# Altium project STB_LightBoard.PrjPcb (part 8 of 10)

## Sheet LED_Driver_NE2R757GT-P6.SchDoc: STB Light Board - red
size A4; Author: flmoll; DrawnBy: flmoll; Organization: PBL; Revision: A; SheetNumber: 19; SheetTotal: 20
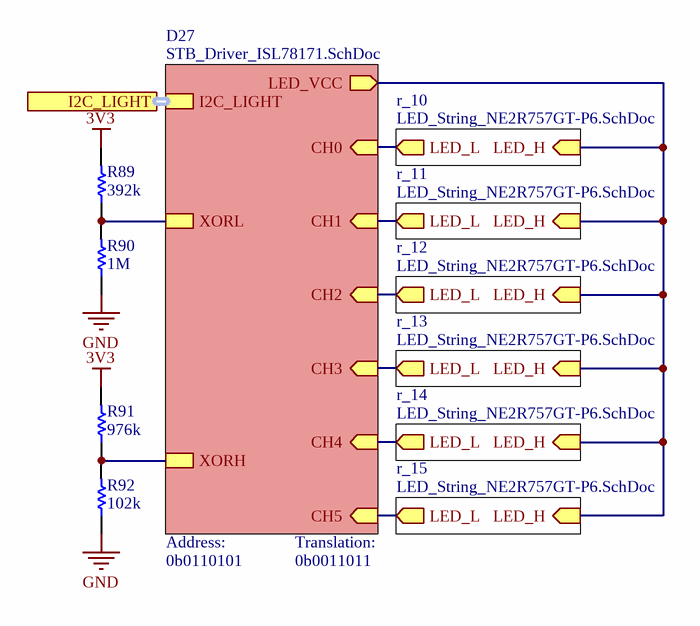
[diagram p16: LED_Driver_NE2R757GT-P6.SchDoc]

### Parts
R89  392k  [RESC1005X40X25LL05T05]
R90  1M  [RESC1005X40X25LL05T05]
R91  976k  [RESC1005X40X25LL05T05]
R92  102k  [RESC1005X40X25LL05T05]

### Sub-sheets
D27 = STB_Driver_ISL78171.SchDoc: CH0 (in), XORL, XORH, LED_VCC (out), CH1 (in), CH2 (in), CH3 (in), CH4 (in), CH5 (in), I2C_LIGHT (harness I2C_LIGHT)
r_10 = LED_String_NE2R757GT-P6.SchDoc: LED_H (in), LED_L (out)
r_11 = LED_String_NE2R757GT-P6.SchDoc: LED_H (in), LED_L (out)
r_12 = LED_String_NE2R757GT-P6.SchDoc: LED_H (in), LED_L (out)
r_13 = LED_String_NE2R757GT-P6.SchDoc: LED_H (in), LED_L (out)
r_14 = LED_String_NE2R757GT-P6.SchDoc: LED_H (in), LED_L (out)
r_15 = LED_String_NE2R757GT-P6.SchDoc: LED_H (in), LED_L (out)

### Ports
I2C_LIGHT (harness I2C_LIGHT, see STB_LightBoard[5C], LED_Driver_AREM-80C0[1A], LED_Driver_AREM-90C0[1A], LED_Driver_NE2B757GT[2B], LED_Driver_NE2G757GT[2B], LED_Driver_NF2L757GT-F1[1A], LED_Driver_NF2W757GT-F1[1A], LED_Driver_QBHP686[1A], STB_Driver_ISL78171[1A], STB_FanControl[1A], STB_UID[1A])

### Nets
3V3: R89.2 R91.2
GND: R90.1 R92.1
NetC7_D27_2: sheet D27/LED_VCC, sheet r_10/LED_H, sheet r_11/LED_H, sheet r_12/LED_H, sheet r_13/LED_H, sheet r_14/LED_H, sheet r_15/LED_H
NetLED134_r_10_1: sheet D27/CH0, sheet r_10/LED_L
NetLED134_r_11_1: sheet D27/CH1, sheet r_11/LED_L
NetLED134_r_12_1: sheet D27/CH2, sheet r_12/LED_L
NetLED134_r_13_1: sheet D27/CH3, sheet r_13/LED_L
NetLED134_r_14_1: sheet D27/CH4, sheet r_14/LED_L
NetLED134_r_15_1: sheet D27/CH5, sheet r_15/LED_L
NetR89_1: R89.1 R90.2 ; sheet D27/XORL
NetR91_1: R91.1 R92.2 ; sheet D27/XORH

### Buses and harness runs
harness port I2C_LIGHT = sheet D27/I2C_LIGHT

### Notes on the sheet
- (near R92) Address:
- 0b0110101
- Translation:
- 0b0011011
- 1
- 2
- 3
- 4
- A
- B
- C
- Project:
- D
- Date:
- Drawing number:
- Rev:
- Format:
- A4 Q
- Drawn by:
- Laboratory:
- Page
- Sheet:
- of
- File:

### Library data of the parts
R89 = CMP-2002-00914-1: Part Number: ERJ-2RKF3923X; Manufacturer: Panasonic; Tolerance: 1%; Rated Power Dissipation (P): 100mW; Rated Temperature: 70°C; Value: 392 kOhm; Temperature Coefficient: 100ppm/°C; Working Voltage: 50V; Package Height: 0.35mm; Package Length: 1mm; Package Width: 0.5mm; Reference Standard: AEC-Q200; Supplier 1: Digi-Key; Supplier Part Number 1: P392KLDKR-ND; Manufacturer Part Number: ERJ-2RKF3923X; RoHS: Yes; Category: Chip SMD Resistors; Stock 1: 100496; Pricing 1: 1=0.10000, 10=0.03300, 100=0.01330, 1000=0.00599, 2500=0.00520, 5000=0.00429 (USD); Mount: Surface Mount; Number of Pins: 2; Size Code: 0402; Terminal Finish: Nickel; Package Shape: Rectangular; Min Operating Temperature: -55°C; Max Operating Temperature: 155°C; JESD-609 Code: e3; Resistor Type: FIXED RESISTOR; Construction: Rectangular; Package Style: SMTMeter; Packaging: Tape and Reel; Technology: METAL GLAZE/THICK FILM; Termination: Wraparound; Reach SVHC Compliant: Yes; RoHS Compliant: Yes; ComponentLink1URL: https://datasheet.ciiva.com:443/pdfs/VipMasterIC/IC/PANA/PANA-S-A0009889626/PANA-S-A0009889626-1.pdf?src-supplier=IHS+Markit; ComponentLink1Description: https://datasheet.ciiva.com:443/pdfs/VipMasterIC/IC/PANA/PANA-S-A0009889626/PANA-S-A0009889626-1.pdf?src-supplier=IHS+Markit; ComponentLink2URL: https://datasheet.ciiva.com/24069/aoa0000ce2-24069223.pdf?src-supplier=Mouser; ComponentLink2Description: https://datasheet.ciiva.com/24069/aoa0000ce2-24069223.pdf?src-supplier=Mouser; ComponentLink3URL: https://datasheet.ciiva.com/30085/aoa0000ce2-30085781.pdf?src-supplier=Onlinecomponents.com; ComponentLink3Description: https://datasheet.ciiva.com/30085/aoa0000ce2-30085781.pdf?src-supplier=Onlinecomponents.com; ComponentLink4URL: https://datasheet.ciiva.com/16781/70260748-16781463.pdf?src-supplier=Allied+Electronics; ComponentLink4Description: https://datasheet.ciiva.com/16781/70260748-16781463.pdf?src-supplier=Allied+Electronics; ComponentLink5URL: https://datasheet.ciiva.com/22673/1678782-22673356.pdf?src-supplier=Element14; ComponentLink5Description: https://datasheet.ciiva.com/22673/1678782-22673356.pdf?src-supplier=Element14; ComponentLink6URL: https://datasheet.ciiva.com/46399/1678782-46399980.pdf?src-supplier=Element14; ComponentLink6Description: https://datasheet.ciiva.com/46399/1678782-46399980.pdf?src-supplier=Element14; ComponentLink7URL: https://datasheet.ciiva.com/46399/1678782-46399981.pdf?src-supplier=Element14; ComponentLink7Description: https://datasheet.ciiva.com/46399/1678782-46399981.pdf?src-supplier=Element14; ComponentLink8URL: https://datasheet.ciiva.com/22776/1678782-22776542.pdf?src-supplier=Farnell; ComponentLink8Description: https://datasheet.ciiva.com/22776/1678782-22776542.pdf?src-supplier=Farnell; ComponentLink9URL: https://datasheet.ciiva.com/16774/70260748-16774815.pdf?src-supplier=Allied+Electronics; ComponentLink9Description: https://datasheet.ciiva.com/16774/70260748-16774815.pdf?src-supplier=Allied+Electronics
R90 = CMP-2002-00609-3: Chip Resistor, 1 MOhm, +/- 1%, 100 mW, -55 to 155 degC, 0402 (1005 Metric), RoHS, Tape and Reel; PartNumber: ERJ-2RKF1004X; Manufacturer: Basic Passives; Voltage Rating: 50 V; Case\/Package: 0402; Value: 1 MOhm; Power Rating: 100 mW; Rated Power Dissipation (P): 100mW; Temperature Coefficient: 100ppm/°C; Working Voltage: 50V; Rated Temperature: 70°C; Package Height: 0.35mm; Package Length: 1mm; Package Width: 0.5mm; Reference Standard: AEC-Q200; Pins: 2; Max Operating Temperature: 155 degC; ComponentLink2URL: http://industrial.panasonic.com/cdbs/www-data/pdf/RDA0000/AOA0000C86.pdf; Weight: 2.8E-05oz; ComponentLink1URL: http://www.panasonic.com/; Radiation Hardening: No; Height: 0.35 mm; Case Code (Imperial): 0402; ComponentLink2Description: Datasheet; Mount: Surface Mount; ComponentLink1Description: Manufacturer URL; REACH SVHC: Yes; Length: 1 mm; Min Operating Temperature: -55 degC; Width: 0.5 mm; Package Quantity: 10000; Tolerance: 1%; PackageDescription: 2-Pin Surface Mount Device, Body 1 x 0.5 mm; RoHSCompliant: true; DatasheetVersion: 04/2015; PackageReference: 0402; Mounting Technology: Surface Mount; Case Code (Metric): 1005; Packaging: Tape and Reel; Supplier 1: Digi-Key; Supplier Part Number 1: P1.00MLDKR-ND; Manufacturer Part Number: ERJ-2RKF1004X; RoHS: Yes; Category: Chip SMD Resistors; Stock 1: 1012879; Pricing 1: 1=0.10000, 10=0.03300, 100=0.01330, 1000=0.00599, 2500=0.00520, 5000=0.00429 (USD); Number of Pins: 2; Package Shape: Rectangular; Size Code: 0402; Terminal Finish: Nickel; JESD-609 Code: e3; Resistor Type: FIXED RESISTOR; Construction: Rectangular; Package Style: SMTMeter; Technology: METAL GLAZE/THICK FILM; Termination: Wraparound; Reach SVHC Compliant: Yes; RoHS Compliant: Yes; ComponentLink3URL: https://datasheet.ciiva.com:443/pdfs/VipMasterIC/IC/PANA/PANA-S-A0009889626/PANA-S-A0009889626-1.pdf?src-supplier=IHS+Markit; ComponentLink3Description: https://datasheet.ciiva.com:443/pdfs/VipMasterIC/IC/PANA/PANA-S-A0009889626/PANA-S-A0009889626-1.pdf?src-supplier=IHS+Markit; ComponentLink4URL: https://datasheet.ciiva.com/34303/1987046-34303551.pdf?src-supplier=Jameco; ComponentLink4Description: https://datasheet.ciiva.com/34303/1987046-34303551.pdf?src-supplier=Jameco; ComponentLink5URL: https://datasheet.ciiva.com/11821/0900766b80f80784-11821229.pdf?src-supplier=RSComponents; ComponentLink5Description: https://datasheet.ciiva.com/11821/0900766b80f80784-11821229.pdf?src-supplier=RSComponents; ComponentLink6URL: https://datasheet.ciiva.com/7909/aoa0000ce2-7909180.pdf?src-supplier=Element14; ComponentLink6Description: https://datasheet.ciiva.com/7909/aoa0000ce2-7909180.pdf?src-supplier=Element14; ComponentLink7URL: https://datasheet.ciiva.com/22723/1678782-22723164.pdf?src-supplier=Element14; ComponentLink7Description: https://datasheet.ciiva.com/22723/1678782-22723164.pdf?src-supplier=Element14; ComponentLink8URL: https://datasheet.ciiva.com/24158/aoa0000ce2-24158990.pdf?src-supplier=Mouser; ComponentLink8Description: https://datasheet.ciiva.com/24158/aoa0000ce2-24158990.pdf?src-supplier=Mouser; ComponentLink9URL: https://datasheet.ciiva.com/16766/70260748-16766711.pdf?src-supplier=Allied+Electronics; ComponentLink9Description: https://datasheet.ciiva.com/16766/70260748-16766711.pdf?src-supplier=Allied+Electronics; ComponentLink10URL: https://datasheet.ciiva.com/16779/70260748-16779288.pdf?src-supplier=Allied+Electronics; ComponentLink10Description: https://datasheet.ciiva.com/16779/70260748-16779288.pdf?src-supplier=Allied+Electronics; ComponentLink11URL: https://datasheet.ciiva.com/16199/aoa0000ce2-16199544.pdf?src-supplier=Future+Electronics; ComponentLink11Description: https://datasheet.ciiva.com/16199/aoa0000ce2-16199544.pdf?src-supplier=Future+Electronics
R91 = CMP-2002-01120-1: Manufacturer: Panasonic; Part Number: ERJ-2RKF9763X; Tolerance: 1%; Rated Power Dissipation (P): 100mW; Rated Temperature: 70°C; Value: 976 kOhm; Temperature Coefficient: 100ppm/°C; Working Voltage: 50V; Package Height: 0.35mm; Package Length: 1mm; Package Width: 0.5mm; Reference Standard: AEC-Q200; Supplier 1: Digi-Key; Supplier Part Number 1: P976KLCT-ND; Manufacturer Part Number: ERJ-2RKF9763X; RoHS: Yes; Category: Chip SMD Resistors; Stock 1: 136638; Pricing 1: 1=0.10000, 10=0.03300, 100=0.01330, 1000=0.00599, 2500=0.00520, 5000=0.00429 (USD); Mount: Surface Mount; Number of Pins: 2; Size Code: 0402; Terminal Finish: Nickel; Package Shape: Rectangular; Min Operating Temperature: -55°C; Max Operating Temperature: 155°C; Resistor Type: FIXED RESISTOR; Construction: Rectangular; Package Style: SMTMeter; Packaging: Tape and Reel; Termination: Wraparound; JESD-609 Code: e3; Technology: METAL GLAZE/THICK FILM; Reach SVHC Compliant: Yes; RoHS Compliant: Yes; ComponentLink1URL: https://datasheet.ciiva.com:443/pdfs/VipMasterIC/IC/PANA/PANA-S-A0009889626/PANA-S-A0009889626-1.pdf?src-supplier=IHS+Markit; ComponentLink1Description: https://datasheet.ciiva.com:443/pdfs/VipMasterIC/IC/PANA/PANA-S-A0009889626/PANA-S-A0009889626-1.pdf?src-supplier=IHS+Markit; ComponentLink2URL: https://datasheet.ciiva.com/43467/1678782-43467581.pdf?src-supplier=Farnell; ComponentLink2Description: https://datasheet.ciiva.com/43467/1678782-43467581.pdf?src-supplier=Farnell; ComponentLink3URL: https://datasheet.ciiva.com/46372/1678782-46372911.pdf?src-supplier=Element14; ComponentLink3Description: https://datasheet.ciiva.com/46372/1678782-46372911.pdf?src-supplier=Element14; ComponentLink4URL: https://datasheet.ciiva.com/22668/1678782-22668415.pdf?src-supplier=Element14; ComponentLink4Description: https://datasheet.ciiva.com/22668/1678782-22668415.pdf?src-supplier=Element14; ComponentLink5URL: https://datasheet.ciiva.com/16758/70260748-16758903.pdf?src-supplier=Allied+Electronics; ComponentLink5Description: https://datasheet.ciiva.com/16758/70260748-16758903.pdf?src-supplier=Allied+Electronics; ComponentLink6URL: https://datasheet.ciiva.com/9179/aoa0000ce2-9179357.pdf?src-supplier=Avnet; ComponentLink6Description: https://datasheet.ciiva.com/9179/aoa0000ce2-9179357.pdf?src-supplier=Avnet; ComponentLink7URL: https://datasheet.ciiva.com/30176/aoa0000ce2-30176831.pdf?src-supplier=Onlinecomponents.com; ComponentLink7Description: https://datasheet.ciiva.com/30176/aoa0000ce2-30176831.pdf?src-supplier=Onlinecomponents.com
R92 = CMP-2002-00613-1: Manufacturer: Panasonic; Part Number: ERJ-2RKF1023X; Tolerance: 1%; Rated Power Dissipation (P): 100mW; Rated Temperature: 70°C; Value: 102 kOhm; Temperature Coefficient: 100ppm/°C; Working Voltage: 50V; Package Height: 0.35mm; Package Length: 1mm; Package Width: 0.5mm; Reference Standard: AEC-Q200; Supplier 1: Digi-Key; Supplier Part Number 1: P102KLDKR-ND; Manufacturer Part Number: ERJ-2RKF1023X; RoHS: Yes; Category: Chip SMD Resistors; Stock 1: 79400; Pricing 1: 1=0.10000, 10=0.03300, 100=0.01330, 1000=0.00599, 2500=0.00520, 5000=0.00429 (USD); Mount: Surface Mount; Number of Pins: 2; Size Code: 0402; Terminal Finish: Nickel; Package Shape: Rectangular; Min Operating Temperature: -55°C; Max Operating Temperature: 155°C; Resistor Type: FIXED RESISTOR; Construction: Rectangular; Package Style: SMTMeter; Packaging: Tape and Reel; Technology: METAL GLAZE/THICK FILM; Termination: Wraparound; JESD-609 Code: e3; Reach SVHC Compliant: Yes; RoHS Compliant: Yes; ComponentLink1URL: https://datasheet.ciiva.com:443/pdfs/VipMasterIC/IC/PANA/PANA-S-A0009889626/PANA-S-A0009889626-1.pdf?src-supplier=IHS+Markit; ComponentLink1Description: https://datasheet.ciiva.com:443/pdfs/VipMasterIC/IC/PANA/PANA-S-A0009889626/PANA-S-A0009889626-1.pdf?src-supplier=IHS+Markit; ComponentLink2URL: https://datasheet.ciiva.com/43467/1678782-43467481.pdf?src-supplier=Farnell; ComponentLink2Description: https://datasheet.ciiva.com/43467/1678782-43467481.pdf?src-supplier=Farnell; ComponentLink3URL: https://datasheet.ciiva.com/9119/aoa0000ce2-9119242.pdf?src-supplier=Avnet; ComponentLink3Description: https://datasheet.ciiva.com/9119/aoa0000ce2-9119242.pdf?src-supplier=Avnet; ComponentLink4URL: https://datasheet.ciiva.com/16781/70260748-16781503.pdf?src-supplier=Allied+Electronics; ComponentLink4Description: https://datasheet.ciiva.com/16781/70260748-16781503.pdf?src-supplier=Allied+Electronics; ComponentLink5URL: https://datasheet.ciiva.com/22673/1678782-22673487.pdf?src-supplier=Element14; ComponentLink5Description: https://datasheet.ciiva.com/22673/1678782-22673487.pdf?src-supplier=Element14; ComponentLink6URL: https://datasheet.ciiva.com/16763/70260748-16763080.pdf?src-supplier=Allied+Electronics; ComponentLink6Description: https://datasheet.ciiva.com/16763/70260748-16763080.pdf?src-supplier=Allied+Electronics; ComponentLink7URL: https://datasheet.ciiva.com/7712/1678782-7712798.pdf?src-supplier=Element14; ComponentLink7Description: https://datasheet.ciiva.com/7712/1678782-7712798.pdf?src-supplier=Element14; ComponentLink8URL: https://datasheet.ciiva.com/46373/1678782-46373215.pdf?src-supplier=Element14; ComponentLink8Description: https://datasheet.ciiva.com/46373/1678782-46373215.pdf?src-supplier=Element14

## Sheet LED_String_NE2R757GT-P6.SchDoc: STB Light Board - blue String
size A4; Author: flmoll; DrawnBy: flmoll; Organization: PBL; Revision: A; SheetNumber: 20; SheetTotal: 20
Used 6 times, as channels LR/r_10, LR/r_11, LR/r_12, LR/r_13, LR/r_14, LR/r_15. Parts and nets are listed once, with the designators drawn on the sheet.
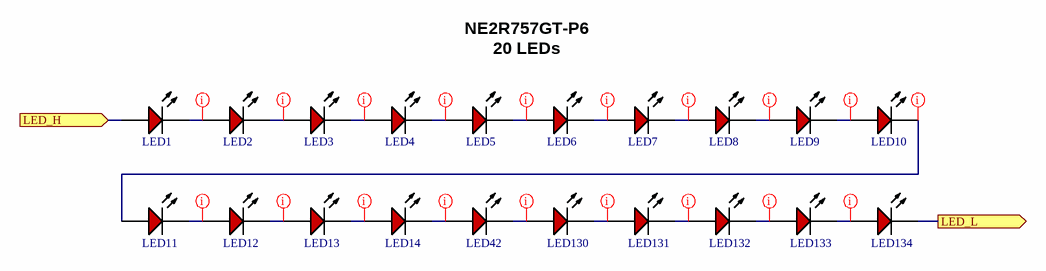
[diagram p17: LED_String_NE2R757GT-P6.SchDoc]

### Parts
LED1  NE2R757GT-P6  [NE2R757GT-P6]  (value not drawn)
LED2  NE2R757GT-P6  [NE2R757GT-P6]  (value not drawn)
LED3  NE2R757GT-P6  [NE2R757GT-P6]  (value not drawn)
LED4  NE2R757GT-P6  [NE2R757GT-P6]  (value not drawn)
LED5  NE2R757GT-P6  [NE2R757GT-P6]  (value not drawn)
LED6  NE2R757GT-P6  [NE2R757GT-P6]  (value not drawn)
LED7  NE2R757GT-P6  [NE2R757GT-P6]  (value not drawn)
LED8  NE2R757GT-P6  [NE2R757GT-P6]  (value not drawn)
LED9  NE2R757GT-P6  [NE2R757GT-P6]  (value not drawn)
LED10  NE2R757GT-P6  [NE2R757GT-P6]  (value not drawn)
LED11  NE2R757GT-P6  [NE2R757GT-P6]  (value not drawn)
LED12  NE2R757GT-P6  [NE2R757GT-P6]  (value not drawn)
LED13  NE2R757GT-P6  [NE2R757GT-P6]  (value not drawn)
LED14  NE2R757GT-P6  [NE2R757GT-P6]  (value not drawn)
LED42  NE2R757GT-P6  [NE2R757GT-P6]  (value not drawn)
LED130  NE2R757GT-P6  [NE2R757GT-P6]  (value not drawn)
LED131  NE2R757GT-P6  [NE2R757GT-P6]  (value not drawn)
LED132  NE2R757GT-P6  [NE2R757GT-P6]  (value not drawn)
LED133  NE2R757GT-P6  [NE2R757GT-P6]  (value not drawn)
LED134  NE2R757GT-P6  [NE2R757GT-P6]  (value not drawn)

### Ports
LED_H (in, see LED_Driver_NE2R757GT-P6[3B]), LED_L (out, see LED_Driver_NE2R757GT-P6[3B])

### Nets
LED_H: LED1.2(A) ; port LED_H
LED_L: LED134.1(K) ; port LED_L
NetLED1_1: LED1.1(K) LED2.2(A)
NetLED2_1: LED2.1(K) LED3.2(A)
NetLED3_1: LED3.1(K) LED4.2(A)
NetLED4_1: LED4.1(K) LED5.2(A)
NetLED5_1: LED5.1(K) LED6.2(A)
NetLED6_1: LED6.1(K) LED7.2(A)
NetLED7_1: LED7.1(K) LED8.2(A)
NetLED8_1: LED8.1(K) LED9.2(A)
NetLED9_1: LED9.1(K) LED10.2(A)
NetLED10_1: LED10.1(K) LED11.2(A)
NetLED11_1: LED11.1(K) LED12.2(A)
NetLED12_1: LED12.1(K) LED13.2(A)
NetLED13_1: LED13.1(K) LED14.2(A)
NetLED14_1: LED14.1(K) LED42.2(A)
NetLED42_1: LED42.1(K) LED130.2(A)
NetLED130_1: LED130.1(K) LED131.2(A)
NetLED131_1: LED131.1(K) LED132.2(A)
NetLED132_1: LED132.1(K) LED133.2(A)
NetLED133_1: LED133.1(K) LED134.2(A)

### Channels
LR/r_10: designators end in _r_10; ports LED_H=NetC7_D27_2 LED_L=NetLED134_r_10_1
LR/r_11: designators end in _r_11; ports LED_H=NetC7_D27_2 LED_L=NetLED134_r_11_1
LR/r_12: designators end in _r_12; ports LED_H=NetC7_D27_2 LED_L=NetLED134_r_12_1
LR/r_13: designators end in _r_13; ports LED_H=NetC7_D27_2 LED_L=NetLED134_r_13_1
LR/r_14: designators end in _r_14; ports LED_H=NetC7_D27_2 LED_L=NetLED134_r_14_1
LR/r_15: designators end in _r_15; ports LED_H=NetC7_D27_2 LED_L=NetLED134_r_15_1

### Layout directives
net class LED: NetLED1_r_10_1, NetLED2_r_10_1, NetLED3_r_10_1, NetLED4_r_10_1, NetLED5_r_10_1, NetLED6_r_10_1, NetLED7_r_10_1, NetLED8_r_10_1, NetLED9_r_10_1, NetLED10_r_10_1, NetLED11_r_10_1, NetLED12_r_10_1, NetLED13_r_10_1, NetLED14_r_10_1, NetLED42_r_10_1, NetLED130_r_10_1, NetLED131_r_10_1, NetLED132_r_10_1, NetLED133_r_10_1

### Notes on the sheet
- NE2R757GT-P6
- 20 LEDs
- 1
- 2
- 3
- 4
- A
- B
- C
- Project:
- D
- Date:
- Drawing number:
- Rev:
- Format:
- A4 Q
- Drawn by:
- Laboratory:
- Page
- Sheet:
- of
- File:

### Library data of the parts
LED1-LED14 LED42 LED130-LED134 = CMP-02062-1: SMD LED Red 2,13 V, 16 lm 3030 (1212); Manufacturer: Nichia; Optoelectronic Device Type: SINGLE COLOR LED; Vf: 2.13 V; Intensity: 16 lm; REACH SVHC: No SVHC; RoHS Compliant: Yes; Color: Red; Manufacturer Part Number: NE2R757GT-P6

## Sheet LED_Driver_NE2B757GT.SchDoc: STB Light Board - blue
size A4; Author: flmoll; DrawnBy: flmoll; Organization: PBL; Revision: A; SheetNumber: 9; SheetTotal: 20
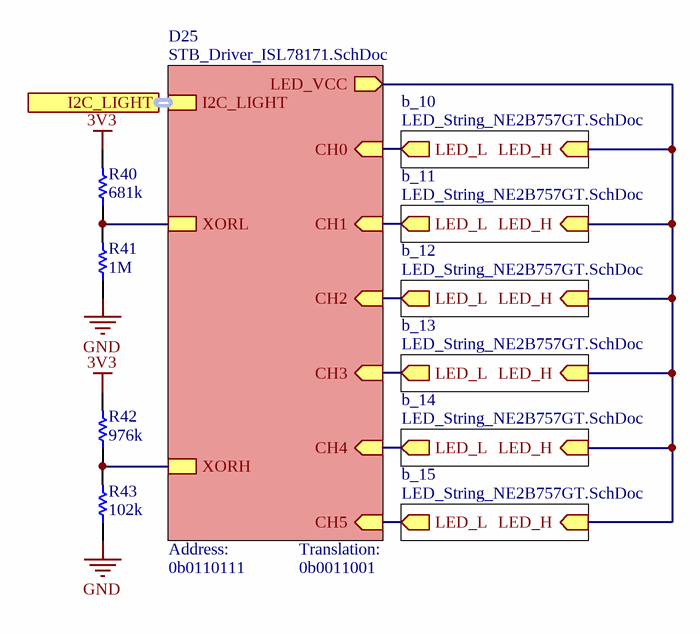
[diagram p18: LED_Driver_NE2B757GT.SchDoc]

### Parts
R40  681k  [RESC1005X40X25LL05T05]
R41  1M  [RESC1005X40X25LL05T05]
R42  976k  [RESC1005X40X25LL05T05]
R43  102k  [RESC1005X40X25LL05T05]

### Sub-sheets
b_10 = LED_String_NE2B757GT.SchDoc: LED_H (in), LED_L (out)
b_11 = LED_String_NE2B757GT.SchDoc: LED_H (in), LED_L (out)
b_12 = LED_String_NE2B757GT.SchDoc: LED_H (in), LED_L (out)
b_13 = LED_String_NE2B757GT.SchDoc: LED_H (in), LED_L (out)
b_14 = LED_String_NE2B757GT.SchDoc: LED_H (in), LED_L (out)
b_15 = LED_String_NE2B757GT.SchDoc: LED_H (in), LED_L (out)
D25 = STB_Driver_ISL78171.SchDoc: CH0 (in), XORL, XORH, LED_VCC (out), CH1 (in), CH2 (in), CH3 (in), CH4 (in), CH5 (in), I2C_LIGHT (harness I2C_LIGHT)

### Ports
I2C_LIGHT (harness I2C_LIGHT, see STB_LightBoard[5C], LED_Driver_AREM-80C0[1A], LED_Driver_AREM-90C0[1A], LED_Driver_NE2G757GT[2B], LED_Driver_NE2R757GT-P6[2B], LED_Driver_NF2L757GT-F1[1A], LED_Driver_NF2W757GT-F1[1A], LED_Driver_QBHP686[1A], STB_Driver_ISL78171[1A], STB_FanControl[1A], STB_UID[1A])

### Nets
3V3: R40.2 R42.2
GND: R41.1 R43.1
NetC7_D25_2: sheet D25/LED_VCC, sheet b_10/LED_H, sheet b_11/LED_H, sheet b_12/LED_H, sheet b_13/LED_H, sheet b_14/LED_H, sheet b_15/LED_H
NetLED148_b_10_1: sheet D25/CH0, sheet b_10/LED_L
NetLED148_b_11_1: sheet D25/CH1, sheet b_11/LED_L
NetLED148_b_12_1: sheet D25/CH2, sheet b_12/LED_L
NetLED148_b_13_1: sheet D25/CH3, sheet b_13/LED_L
NetLED148_b_14_1: sheet D25/CH4, sheet b_14/LED_L
NetLED148_b_15_1: sheet D25/CH5, sheet b_15/LED_L
NetR40_1: R40.1 R41.2 ; sheet D25/XORL
NetR42_1: R42.1 R43.2 ; sheet D25/XORH

### Buses and harness runs
harness port I2C_LIGHT = sheet D25/I2C_LIGHT

### Notes on the sheet
- (near R43) Address:
- 0b0110111
- Translation:
- 0b0011001
- 1
- 2
- 3
- 4
- A
- B
- C
- Project:
- D
- Date:
- Drawing number:
- Rev:
- Format:
- A4 Q
- Drawn by:
- Laboratory:
- Page
- Sheet:
- of
- File:

### Library data of the parts
R40 = CMP-2002-01040-1: Manufacturer: Panasonic; Part Number: ERJ-2RKF6813X; Tolerance: 1%; Rated Power Dissipation (P): 100mW; Rated Temperature: 70°C; Value: 681 kOhm; Temperature Coefficient: 100ppm/°C; Working Voltage: 50V; Package Height: 0.35mm; Package Length: 1mm; Package Width: 0.5mm; Reference Standard: AEC-Q200; Supplier 1: Digi-Key; Supplier Part Number 1: P681KLCT-ND; Manufacturer Part Number: ERJ-2RKF6813X; RoHS: Yes; Category: Chip SMD Resistors; Stock 1: 3837; Pricing 1: 1=0.10000, 10=0.03300, 100=0.01330, 1000=0.00599, 2500=0.00520, 5000=0.00429 (USD); Mount: Surface Mount; Number of Pins: 2; Size Code: 0402; Terminal Finish: Nickel; Package Shape: Rectangular; Min Operating Temperature: -55°C; Max Operating Temperature: 155°C; Resistor Type: FIXED RESISTOR; Packaging: Tape and Reel; Termination: Wraparound; Construction: Rectangular; Package Style: SMTMeter; Technology: METAL GLAZE/THICK FILM; JESD-609 Code: e3; Reach SVHC Compliant: Yes; RoHS Compliant: Yes; ComponentLink1URL: https://datasheet.ciiva.com:443/pdfs/VipMasterIC/IC/PANA/PANA-S-A0009889626/PANA-S-A0009889626-1.pdf?src-supplier=IHS+Markit; ComponentLink1Description: https://datasheet.ciiva.com:443/pdfs/VipMasterIC/IC/PANA/PANA-S-A0009889626/PANA-S-A0009889626-1.pdf?src-supplier=IHS+Markit; ComponentLink2URL: https://datasheet.ciiva.com/3883/3984280s8821682n1386-3883650.pdf?src-supplier=Arrow+Electronics; ComponentLink2Description: https://datasheet.ciiva.com/3883/3984280s8821682n1386-3883650.pdf?src-supplier=Arrow+Electronics; ComponentLink3URL: https://datasheet.ciiva.com/16776/70260748-16776822.pdf?src-supplier=Allied+Electronics; ComponentLink3Description: https://datasheet.ciiva.com/16776/70260748-16776822.pdf?src-supplier=Allied+Electronics; ComponentLink4URL: https://datasheet.ciiva.com/9180/aoa0000ce2-9180392.pdf?src-supplier=Avnet; ComponentLink4Description: https://datasheet.ciiva.com/9180/aoa0000ce2-9180392.pdf?src-supplier=Avnet; ComponentLink5URL: https://datasheet.ciiva.com/22673/1678782-22673368.pdf?src-supplier=Element14; ComponentLink5Description: https://datasheet.ciiva.com/22673/1678782-22673368.pdf?src-supplier=Element14; ComponentLink6URL: https://datasheet.ciiva.com/7753/1678782-7753993.pdf?src-supplier=Element14; ComponentLink6Description: https://datasheet.ciiva.com/7753/1678782-7753993.pdf?src-supplier=Element14; ComponentLink7URL: https://datasheet.ciiva.com/16771/70260748-16771449.pdf?src-supplier=Allied+Electronics; ComponentLink7Description: https://datasheet.ciiva.com/16771/70260748-16771449.pdf?src-supplier=Allied+Electronics; ComponentLink8URL: https://datasheet.ciiva.com/9180/aoa0000ce2-9180348.pdf?src-supplier=Avnet; ComponentLink8Description: https://datasheet.ciiva.com/9180/aoa0000ce2-9180348.pdf?src-supplier=Avnet; ComponentLink9URL: https://datasheet.ciiva.com/43467/1678782-43467564.pdf?src-supplier=Farnell; ComponentLink9Description: https://datasheet.ciiva.com/43467/1678782-43467564.pdf?src-supplier=Farnell; ComponentLink10URL: https://datasheet.ciiva.com/24069/aoa0000ce2-24069822.pdf?src-supplier=Mouser; ComponentLink10Description: https://datasheet.ciiva.com/24069/aoa0000ce2-24069822.pdf?src-supplier=Mouser; ComponentLink11URL: https://datasheet.ciiva.com/46373/1678782-46373118.pdf?src-supplier=Element14; ComponentLink11Description: https://datasheet.ciiva.com/46373/1678782-46373118.pdf?src-supplier=Element14; ComponentLink12URL: https://datasheet.ciiva.com/30230/aoa0000ce2-30230479.pdf?src-supplier=Onlinecomponents.com; ComponentLink12Description: https://datasheet.ciiva.com/30230/aoa0000ce2-30230479.pdf?src-supplier=Onlinecomponents.com; ComponentLink13URL: https://datasheet.ciiva.com/46373/1678782-46373119.pdf?src-supplier=Element14; ComponentLink13Description: https://datasheet.ciiva.com/46373/1678782-46373119.pdf?src-supplier=Element14
R41 = CMP-2002-00609-3: as R90 on sheet LED_Driver_NE2R757GT-P6; Pins: 2; Max Operating Temperature: 155 degC; ComponentLink2URL: http://industrial.panasonic.com/cdbs/www-data/pdf/RDA0000/AOA0000C86.pdf; Weight: 2.8E-05oz; ComponentLink1URL: http://www.panasonic.com/; Radiation Hardening: No; Height: 0.35 mm; Case Code (Imperial): 0402; ComponentLink2Description: Datasheet; Mount: Surface Mount; ComponentLink1Description: Manufacturer URL; REACH SVHC: Yes; Length: 1 mm; Min Operating Temperature: -55 degC; Width: 0.5 mm; Package Quantity: 10000; Tolerance: 1%; PackageDescription: 2-Pin Surface Mount Device, Body 1 x 0.5 mm; RoHSCompliant: true; DatasheetVersion: 04/2015; PackageReference: 0402; Mounting Technology: Surface Mount; Case Code (Metric): 1005; Packaging: Tape and Reel; Supplier 1: Digi-Key; Supplier Part Number 1: P1.00MLDKR-ND; Manufacturer Part Number: ERJ-2RKF1004X; RoHS: Yes; Category: Chip SMD Resistors; Stock 1: 1012879; Pricing 1: 1=0.10000, 10=0.03300, 100=0.01330, 1000=0.00599, 2500=0.00520, 5000=0.00429 (USD); Number of Pins: 2; Package Shape: Rectangular; Size Code: 0402; Terminal Finish: Nickel; JESD-609 Code: e3; Resistor Type: FIXED RESISTOR; Construction: Rectangular; Package Style: SMTMeter; Technology: METAL GLAZE/THICK FILM; Termination: Wraparound; Reach SVHC Compliant: Yes; RoHS Compliant: Yes; ComponentLink3URL: https://datasheet.ciiva.com:443/pdfs/VipMasterIC/IC/PANA/PANA-S-A0009889626/PANA-S-A0009889626-1.pdf?src-supplier=IHS+Markit; ComponentLink3Description: https://datasheet.ciiva.com:443/pdfs/VipMasterIC/IC/PANA/PANA-S-A0009889626/PANA-S-A0009889626-1.pdf?src-supplier=IHS+Markit; ComponentLink4URL: https://datasheet.ciiva.com/34303/1987046-34303551.pdf?src-supplier=Jameco; ComponentLink4Description: https://datasheet.ciiva.com/34303/1987046-34303551.pdf?src-supplier=Jameco; ComponentLink5URL: https://datasheet.ciiva.com/11821/0900766b80f80784-11821229.pdf?src-supplier=RSComponents; ComponentLink5Description: https://datasheet.ciiva.com/11821/0900766b80f80784-11821229.pdf?src-supplier=RSComponents; ComponentLink6URL: https://datasheet.ciiva.com/7909/aoa0000ce2-7909180.pdf?src-supplier=Element14; ComponentLink6Description: https://datasheet.ciiva.com/7909/aoa0000ce2-7909180.pdf?src-supplier=Element14; ComponentLink7URL: https://datasheet.ciiva.com/22723/1678782-22723164.pdf?src-supplier=Element14; ComponentLink7Description: https://datasheet.ciiva.com/22723/1678782-22723164.pdf?src-supplier=Element14; ComponentLink8URL: https://datasheet.ciiva.com/24158/aoa0000ce2-24158990.pdf?src-supplier=Mouser; ComponentLink8Description: https://datasheet.ciiva.com/24158/aoa0000ce2-24158990.pdf?src-supplier=Mouser; ComponentLink9URL: https://datasheet.ciiva.com/16766/70260748-16766711.pdf?src-supplier=Allied+Electronics; ComponentLink9Description: https://datasheet.ciiva.com/16766/70260748-16766711.pdf?src-supplier=Allied+Electronics; ComponentLink10URL: https://datasheet.ciiva.com/16779/70260748-16779288.pdf?src-supplier=Allied+Electronics; ComponentLink10Description: https://datasheet.ciiva.com/16779/70260748-16779288.pdf?src-supplier=Allied+Electronics; ComponentLink11URL: https://datasheet.ciiva.com/16199/aoa0000ce2-16199544.pdf?src-supplier=Future+Electronics; ComponentLink11Description: https://datasheet.ciiva.com/16199/aoa0000ce2-16199544.pdf?src-supplier=Future+Electronics
R42 = CMP-2002-01120-1: as R91 on sheet LED_Driver_NE2R757GT-P6; Supplier 1: Digi-Key; Supplier Part Number 1: P976KLCT-ND; Manufacturer Part Number: ERJ-2RKF9763X; RoHS: Yes; Category: Chip SMD Resistors; Stock 1: 136638; Pricing 1: 1=0.10000, 10=0.03300, 100=0.01330, 1000=0.00599, 2500=0.00520, 5000=0.00429 (USD); Mount: Surface Mount; Number of Pins: 2; Size Code: 0402; Terminal Finish: Nickel; Package Shape: Rectangular; Min Operating Temperature: -55°C; Max Operating Temperature: 155°C; Resistor Type: FIXED RESISTOR; Construction: Rectangular; Package Style: SMTMeter; Packaging: Tape and Reel; Termination: Wraparound; JESD-609 Code: e3; Technology: METAL GLAZE/THICK FILM; Reach SVHC Compliant: Yes; RoHS Compliant: Yes; ComponentLink1URL: https://datasheet.ciiva.com:443/pdfs/VipMasterIC/IC/PANA/PANA-S-A0009889626/PANA-S-A0009889626-1.pdf?src-supplier=IHS+Markit; ComponentLink1Description: https://datasheet.ciiva.com:443/pdfs/VipMasterIC/IC/PANA/PANA-S-A0009889626/PANA-S-A0009889626-1.pdf?src-supplier=IHS+Markit; ComponentLink2URL: https://datasheet.ciiva.com/43467/1678782-43467581.pdf?src-supplier=Farnell; ComponentLink2Description: https://datasheet.ciiva.com/43467/1678782-43467581.pdf?src-supplier=Farnell; ComponentLink3URL: https://datasheet.ciiva.com/46372/1678782-46372911.pdf?src-supplier=Element14; ComponentLink3Description: https://datasheet.ciiva.com/46372/1678782-46372911.pdf?src-supplier=Element14; ComponentLink4URL: https://datasheet.ciiva.com/22668/1678782-22668415.pdf?src-supplier=Element14; ComponentLink4Description: https://datasheet.ciiva.com/22668/1678782-22668415.pdf?src-supplier=Element14; ComponentLink5URL: https://datasheet.ciiva.com/16758/70260748-16758903.pdf?src-supplier=Allied+Electronics; ComponentLink5Description: https://datasheet.ciiva.com/16758/70260748-16758903.pdf?src-supplier=Allied+Electronics; ComponentLink6URL: https://datasheet.ciiva.com/9179/aoa0000ce2-9179357.pdf?src-supplier=Avnet; ComponentLink6Description: https://datasheet.ciiva.com/9179/aoa0000ce2-9179357.pdf?src-supplier=Avnet; ComponentLink7URL: https://datasheet.ciiva.com/30176/aoa0000ce2-30176831.pdf?src-supplier=Onlinecomponents.com; ComponentLink7Description: https://datasheet.ciiva.com/30176/aoa0000ce2-30176831.pdf?src-supplier=Onlinecomponents.com
R43 = CMP-2002-00613-1: as R92 on sheet LED_Driver_NE2R757GT-P6; Supplier 1: Digi-Key; Supplier Part Number 1: P102KLDKR-ND; Manufacturer Part Number: ERJ-2RKF1023X; RoHS: Yes; Category: Chip SMD Resistors; Stock 1: 79400; Pricing 1: 1=0.10000, 10=0.03300, 100=0.01330, 1000=0.00599, 2500=0.00520, 5000=0.00429 (USD); Mount: Surface Mount; Number of Pins: 2; Size Code: 0402; Terminal Finish: Nickel; Package Shape: Rectangular; Min Operating Temperature: -55°C; Max Operating Temperature: 155°C; Resistor Type: FIXED RESISTOR; Construction: Rectangular; Package Style: SMTMeter; Packaging: Tape and Reel; Technology: METAL GLAZE/THICK FILM; Termination: Wraparound; JESD-609 Code: e3; Reach SVHC Compliant: Yes; RoHS Compliant: Yes; ComponentLink1URL: https://datasheet.ciiva.com:443/pdfs/VipMasterIC/IC/PANA/PANA-S-A0009889626/PANA-S-A0009889626-1.pdf?src-supplier=IHS+Markit; ComponentLink1Description: https://datasheet.ciiva.com:443/pdfs/VipMasterIC/IC/PANA/PANA-S-A0009889626/PANA-S-A0009889626-1.pdf?src-supplier=IHS+Markit; ComponentLink2URL: https://datasheet.ciiva.com/43467/1678782-43467481.pdf?src-supplier=Farnell; ComponentLink2Description: https://datasheet.ciiva.com/43467/1678782-43467481.pdf?src-supplier=Farnell; ComponentLink3URL: https://datasheet.ciiva.com/9119/aoa0000ce2-9119242.pdf?src-supplier=Avnet; ComponentLink3Description: https://datasheet.ciiva.com/9119/aoa0000ce2-9119242.pdf?src-supplier=Avnet; ComponentLink4URL: https://datasheet.ciiva.com/16781/70260748-16781503.pdf?src-supplier=Allied+Electronics; ComponentLink4Description: https://datasheet.ciiva.com/16781/70260748-16781503.pdf?src-supplier=Allied+Electronics; ComponentLink5URL: https://datasheet.ciiva.com/22673/1678782-22673487.pdf?src-supplier=Element14; ComponentLink5Description: https://datasheet.ciiva.com/22673/1678782-22673487.pdf?src-supplier=Element14; ComponentLink6URL: https://datasheet.ciiva.com/16763/70260748-16763080.pdf?src-supplier=Allied+Electronics; ComponentLink6Description: https://datasheet.ciiva.com/16763/70260748-16763080.pdf?src-supplier=Allied+Electronics; ComponentLink7URL: https://datasheet.ciiva.com/7712/1678782-7712798.pdf?src-supplier=Element14; ComponentLink7Description: https://datasheet.ciiva.com/7712/1678782-7712798.pdf?src-supplier=Element14; ComponentLink8URL: https://datasheet.ciiva.com/46373/1678782-46373215.pdf?src-supplier=Element14; ComponentLink8Description: https://datasheet.ciiva.com/46373/1678782-46373215.pdf?src-supplier=Element14

## Sheet LED_String_NE2B757GT.SchDoc: STB Light Board - blue String
size A4; Author: flmoll; DrawnBy: flmoll; Organization: PBL; Revision: A; SheetNumber: 10; SheetTotal: 20
Used 6 times, as channels LB/b_10, LB/b_11, LB/b_12, LB/b_13, LB/b_14, LB/b_15. Parts and nets are listed once, with the designators drawn on the sheet.
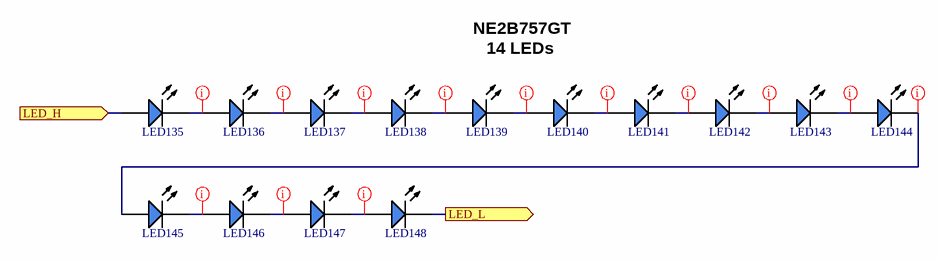
[diagram p19: LED_String_NE2B757GT.SchDoc]

### Parts
LED135  NE2B757GT  [NE2B757GT]  (value not drawn)
LED136  NE2B757GT  [NE2B757GT]  (value not drawn)
LED137  NE2B757GT  [NE2B757GT]  (value not drawn)
LED138  NE2B757GT  [NE2B757GT]  (value not drawn)
LED139  NE2B757GT  [NE2B757GT]  (value not drawn)
LED140  NE2B757GT  [NE2B757GT]  (value not drawn)
LED141  NE2B757GT  [NE2B757GT]  (value not drawn)
LED142  NE2B757GT  [NE2B757GT]  (value not drawn)
LED143  NE2B757GT  [NE2B757GT]  (value not drawn)
LED144  NE2B757GT  [NE2B757GT]  (value not drawn)
LED145  NE2B757GT  [NE2B757GT]  (value not drawn)
LED146  NE2B757GT  [NE2B757GT]  (value not drawn)
LED147  NE2B757GT  [NE2B757GT]  (value not drawn)
LED148  NE2B757GT  [NE2B757GT]  (value not drawn)

### Ports
LED_H (in, see LED_Driver_NE2B757GT[3B]), LED_L (out, see LED_Driver_NE2B757GT[3B])

### Nets
LED_H: LED135.2(A) ; port LED_H
LED_L: LED148.1(K) ; port LED_L
NetLED135_1: LED135.1(K) LED136.2(A)
NetLED136_1: LED136.1(K) LED137.2(A)
NetLED137_1: LED137.1(K) LED138.2(A)
NetLED138_1: LED138.1(K) LED139.2(A)
NetLED139_1: LED139.1(K) LED140.2(A)
NetLED140_1: LED140.1(K) LED141.2(A)
NetLED141_1: LED141.1(K) LED142.2(A)
NetLED142_1: LED142.1(K) LED143.2(A)
NetLED143_1: LED143.1(K) LED144.2(A)
NetLED144_1: LED144.1(K) LED145.2(A)
NetLED145_1: LED145.1(K) LED146.2(A)
NetLED146_1: LED146.1(K) LED147.2(A)
NetLED147_1: LED147.1(K) LED148.2(A)

### Channels
LB/b_10: designators end in _b_10; ports LED_H=NetC7_D25_2 LED_L=NetLED148_b_10_1
LB/b_11: designators end in _b_11; ports LED_H=NetC7_D25_2 LED_L=NetLED148_b_11_1
LB/b_12: designators end in _b_12; ports LED_H=NetC7_D25_2 LED_L=NetLED148_b_12_1
LB/b_13: designators end in _b_13; ports LED_H=NetC7_D25_2 LED_L=NetLED148_b_13_1
LB/b_14: designators end in _b_14; ports LED_H=NetC7_D25_2 LED_L=NetLED148_b_14_1
LB/b_15: designators end in _b_15; ports LED_H=NetC7_D25_2 LED_L=NetLED148_b_15_1

### Layout directives
net class LED: NetLED135_b_10_1, NetLED136_b_10_1, NetLED137_b_10_1, NetLED138_b_10_1, NetLED139_b_10_1, NetLED140_b_10_1, NetLED141_b_10_1, NetLED142_b_10_1, NetLED143_b_10_1, NetLED144_b_10_1, NetLED145_b_10_1, NetLED146_b_10_1, NetLED147_b_10_1

### Notes on the sheet
- NE2B757GT
- 14 LEDs
- 1
- 2
- 3
- 4
- A
- B
- C
- Project:
- D
- Date:
- Drawing number:
- Rev:
- Format:
- A4 Q
- Drawn by:
- Laboratory:
- Page
- Sheet:
- of
- File:

### Library data of the parts
LED135-LED148 = CMP-02060-1: SMD LED White 2,9 V, 8,7 lm 3030 (1212); Manufacturer: Nichia; Optoelectronic Device Type: SINGLE COLOR LED; Color: Blue; Vf: 2.9 V; Intensity: 8.7 lm; REACH SVHC: No SVHC; RoHS Compliant: Yes; Manufacturer Part Number: NE2B757GT